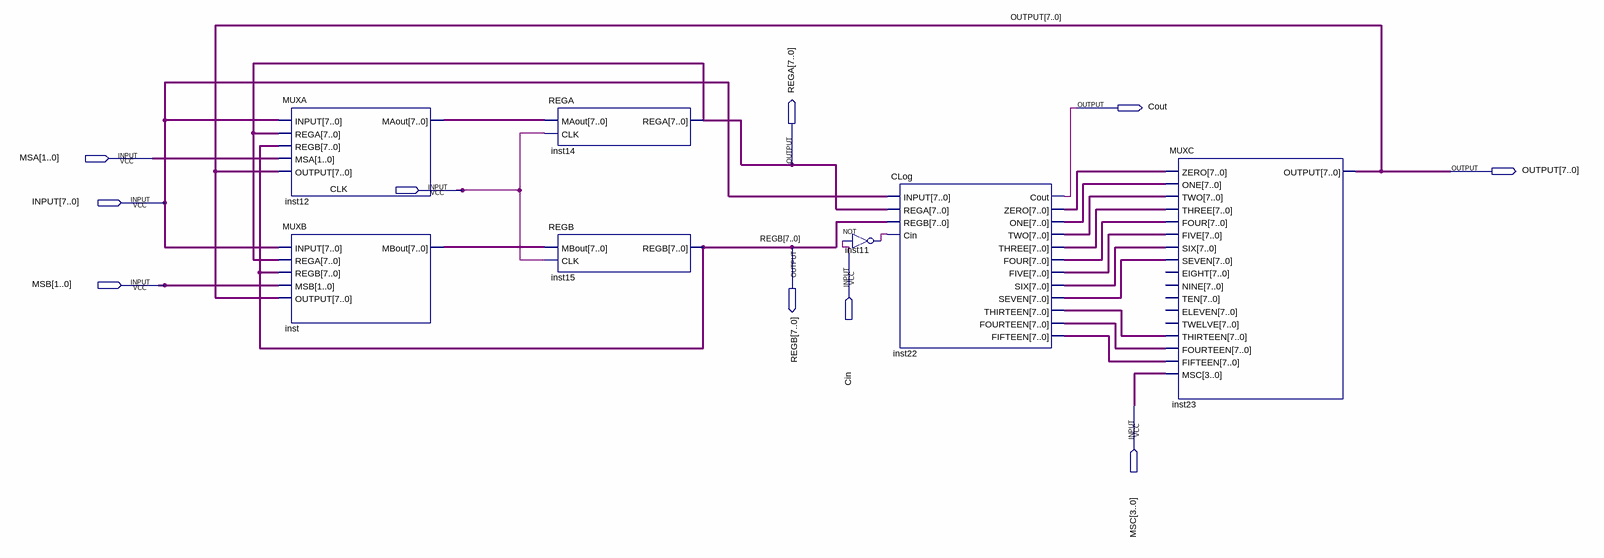
[diagram p0: schematic sheet]
// Quartus schematic Lab7.bdf as structural Verilog: 7 symbols, 10 pins
module Lab7 (
  input  [1:0] MSA,
  input  CLK,
  input  [7:0] INPUT,
  input  Cin,
  input  [1:0] MSB,
  input  [3:0] MSC,
  output Cout,
  output [7:0] REGA,
  output [7:0] OUTPUT,
  output [7:0] REGB
);

  wire inst11_out;
  wire [7:0] inst12_maout, inst22_fifteen, inst22_five, inst22_four, inst22_fourteen, inst22_one,
       inst22_seven, inst22_six, inst22_thirteen, inst22_three, inst22_two, inst22_zero, inst_mbout;

  MUXA inst12 (.INPUT(INPUT), .REGA(REGA), .REGB(REGB), .MSA(MSA), .OUTPUT(OUTPUT), .MAout(inst12_maout));
  MUXB inst (.INPUT(INPUT), .REGA(REGA), .REGB(REGB), .MSB(MSB), .OUTPUT(OUTPUT), .MBout(inst_mbout));
  REGA inst14 (.MAout(inst12_maout), .CLK(CLK), .REGA(REGA));
  REGB inst15 (.MBout(inst_mbout), .CLK(CLK), .REGB(REGB));
  not inst11 (inst11_out, Cin);
  CLog inst22 (
    .INPUT(INPUT), .REGA(REGA), .REGB(REGB), .Cin(inst11_out), .Cout(Cout), .ZERO(inst22_zero),
    .ONE(inst22_one), .TWO(inst22_two), .THREE(inst22_three), .FOUR(inst22_four), .FIVE(inst22_five),
    .SIX(inst22_six), .SEVEN(inst22_seven), .THIRTEEN(inst22_thirteen), .FOURTEEN(inst22_fourteen),
    .FIFTEEN(inst22_fifteen));
  MUXC inst23 (
    .ZERO(inst22_zero), .ONE(inst22_one), .TWO(inst22_two), .THREE(inst22_three), .FOUR(inst22_four),
    .FIVE(inst22_five), .SIX(inst22_six), .SEVEN(inst22_seven), .THIRTEEN(inst22_thirteen),
    .FOURTEEN(inst22_fourteen), .FIFTEEN(inst22_fifteen), .MSC(MSC), .OUTPUT(OUTPUT));  // open: EIGHT, NINE, TEN, ELEVEN, TWELVE
endmodule
